# EAGLE design v2 (EAGLE 7.2.0)
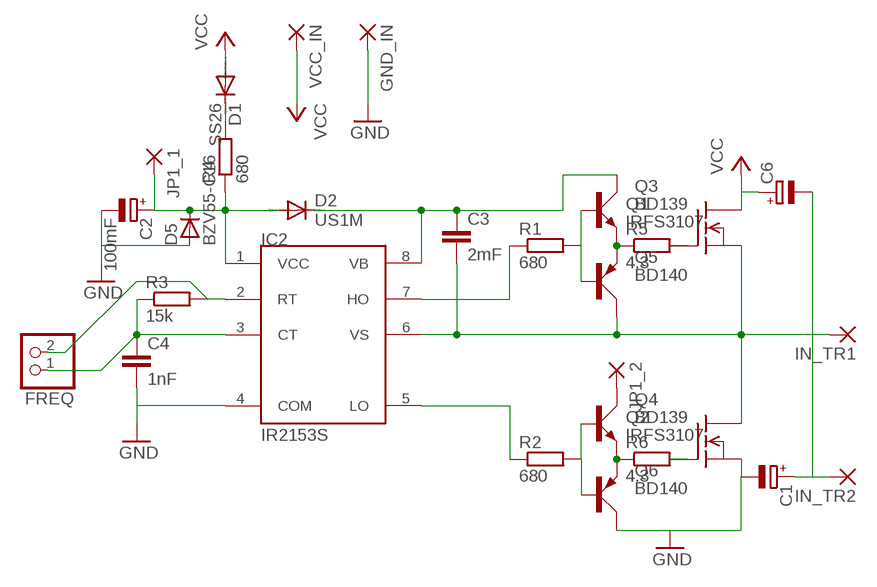
[diagram p0: schematic, sheet 1]

## Parts
C1  CPOL-EUE10-22.5  [EB22,5D]
C2  100mF  CPOL-EUE5-10.5  [E5-10,5]
C3  2mF  C-EUC0805  [C0805]
C4  1nF  C-EUC0805  [C0805]
C6  CPOL-EUE10-22.5  [EB22,5D]
D1  SS26  DIODE-DO-214AC  [DO-214AC]
D2  US1M  DIODE-DO-214AC  [DO-214AC]
D5  BZV55-C16  D-SOD-80  [SOD80]
FREQ  PINHD-1X2/90  [1X02/90]
GND_IN  SMD5  [SMD2,54-5,08]
IC2  IR2153S  [SO08]
IN_TR1  SMD5  [SMD2,54-5,08]
IN_TR2  SMD5  [SMD2,54-5,08]
JP1_1  1,6/0,8  [1,6/0,8]
JP1_2  1,6/0,8  [1,6/0,8]
Q1  IRFS3107  IRF510D2PAK  [D2PAK]
Q2  IRFS3107  IRF510D2PAK  [D2PAK]
Q3  BD139  [TO126AV]
Q4  BD139  [TO126AV]
Q5  BD140  [TO126AV]
Q6  BD140  [TO126AV]
R1  680  R-EU_R0805  [R0805]
R2  680  R-EU_R0805  [R0805]
R3  15k  R-EU_R0805  [R0805]
R4  680  R-EU_R0805  [R0805]
R5  4.3  R-EU_R0805  [R0805]
R6  4.3  R-EU_R0805  [R0805]
VCC_IN  SMD5  [SMD2,54-5,08]

## Nets
GND: C1.- C2.- C4.2 D5.2(A) GND_IN.1(P) IC2.4(COM) Q2.3(S) Q6.C
IN_TR1: C3.2 IC2.6(VS) IN_TR1.1(P) Q1.3(S) Q2.2(D) Q5.C
IN_TR2: C1.+ C6.- IN_TR2.1(P)
N$1: Q3.B Q5.B R1.2
N$2: Q4.B Q6.B R2.2
N$4: Q3.E Q5.E R5.1
N$5: Q4.E Q6.E R6.1
N$6: Q1.1(G) R5.2
N$7: FREQ.2 IC2.2(RT) R3.2
N$8: C4.1 FREQ.1 IC2.3(CT) R3.1
N$9: Q2.1(G) R6.2
N$10: IC2.7(HO) R1.1
N$11: IC2.5(LO) R2.1
N$12: D1.C R4.2
N$13: JP1_2.1(P) Q4.C
VB: C3.1 D2.C IC2.8(VB) Q3.C
VCC: C6.+ D1.A Q1.2(D) VCC_IN.1(P)
VCC_IR: C2.+ D2.A D5.1(C) IC2.1(VCC) JP1_1.1(P) R4.1

## Library data of the parts
C1 C2 C6 = rcl:CPOL-EU: POLARIZED CAPACITOR, European symbol
C3 C4 = rcl:C-EU: CAPACITOR, European symbol
D1 D2 = diode:DIODE-: DIODE
D5 = semicon-smd-ipc:D-: DIODE unfilled
FREQ = pinhead:PINHD-1X2: PIN HEADER
GND_IN IN_TR1 IN_TR2 VCC_IN = wirepad:SMD5: SMD PAD
IC2 = irs:IR2153
JP1_1 JP1_2 = wirepad:1,6/0,8: THROUGH-HOLE PAD
Q1 Q2 = my_mixed:IRF510: N-Channel Enhancement MOSFET (HEXFET); 100V; 5,6A; 0,54Ohm
Q3 Q4 = transistor-power:BD139: NPN TRANSISTOR
Q5 Q6 = transistor-power:BD140: PNP TRANSISTOR
R1-R6 = rcl:R-EU_: RESISTOR, European symbol

## Board
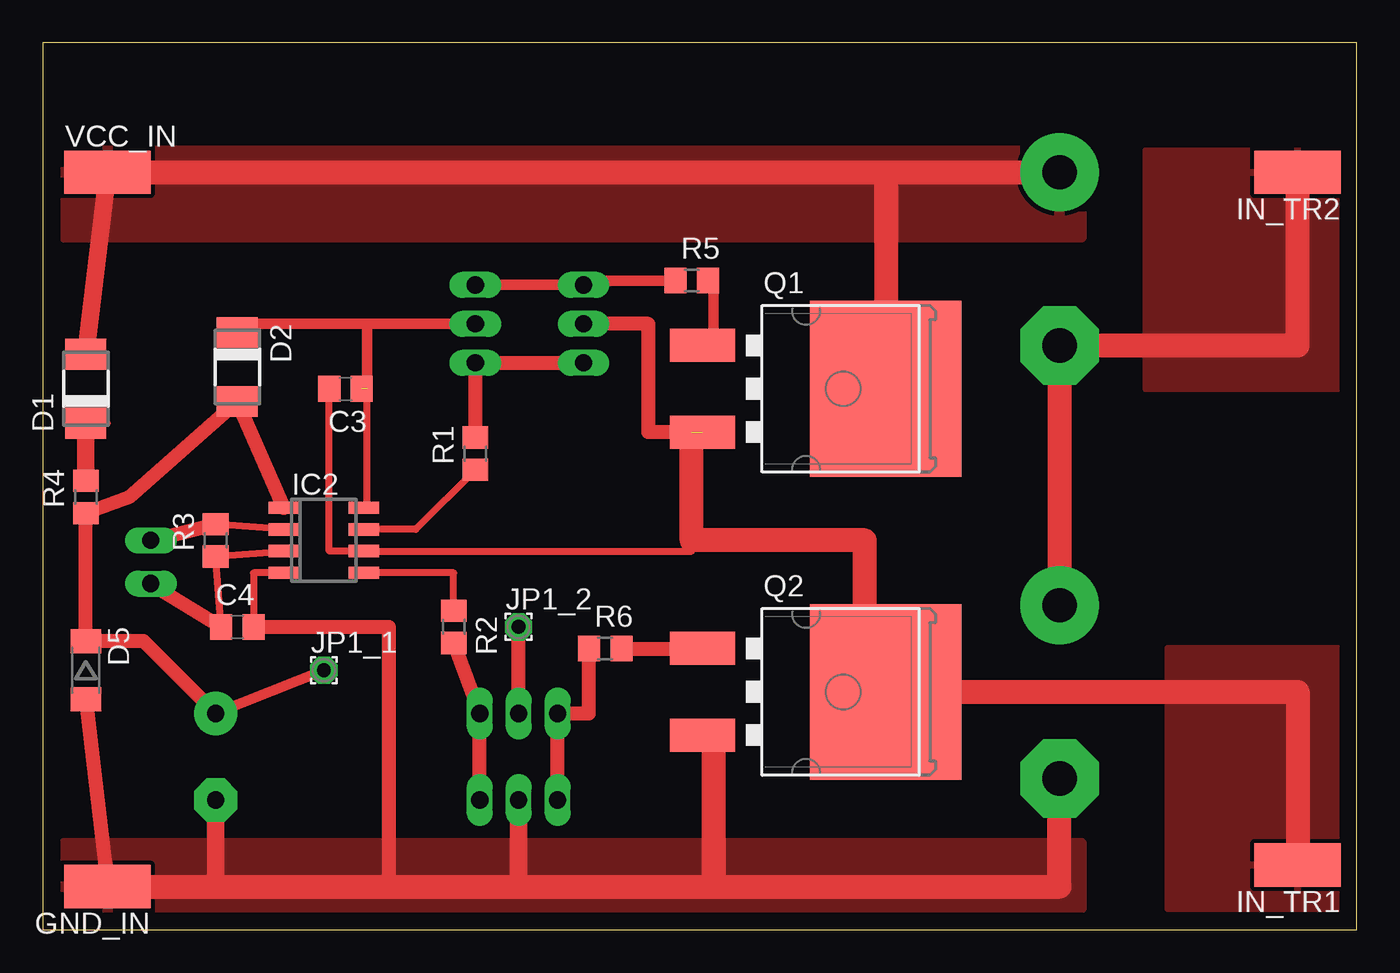
[diagram p1: board, top side]
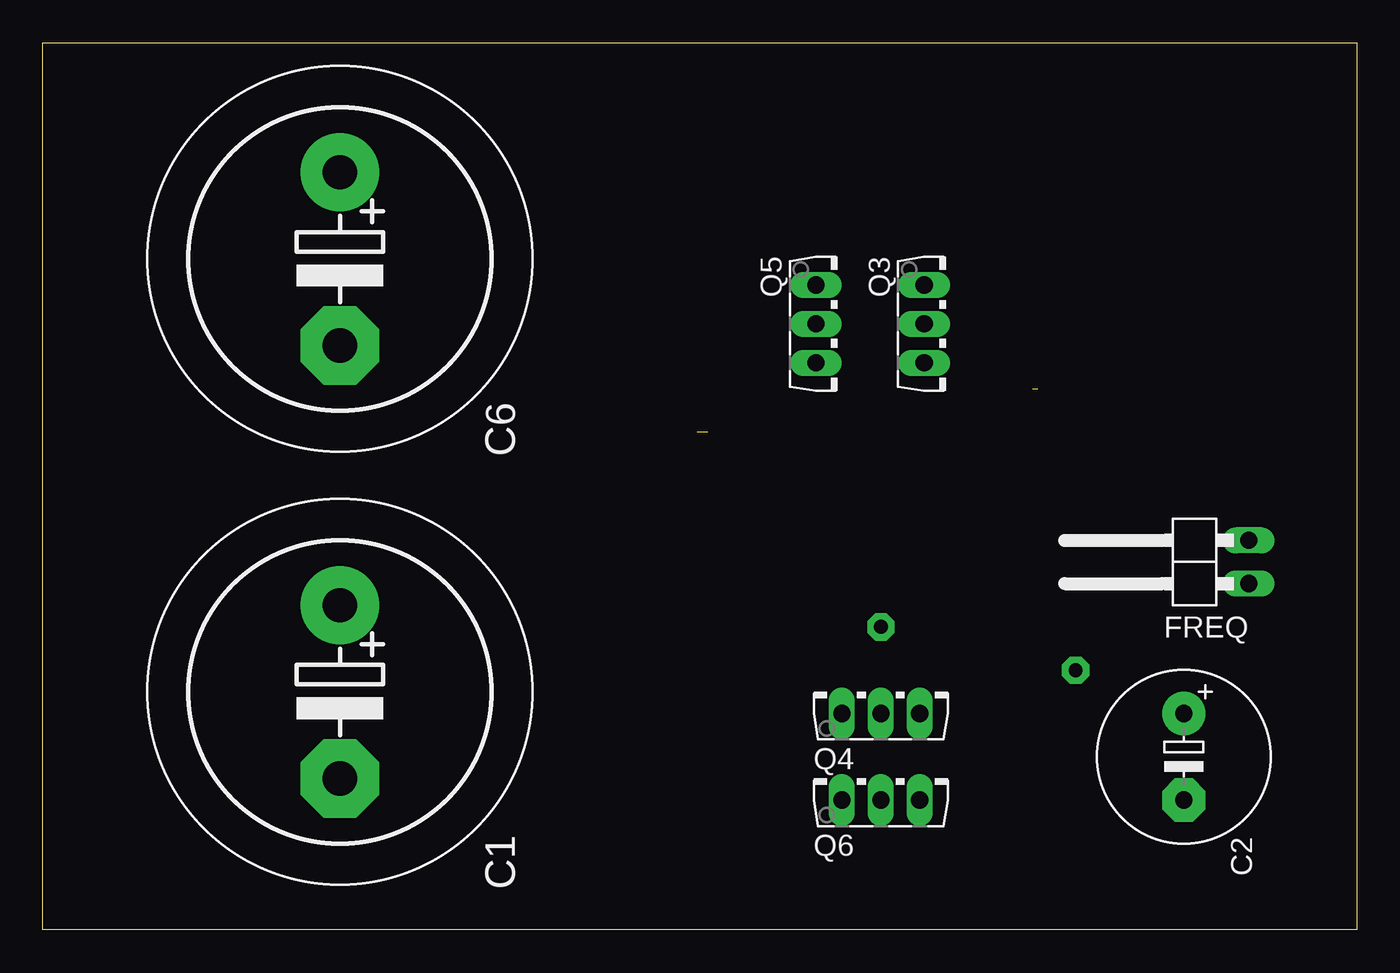
[diagram p2: board, bottom side, seen from below]

Size 77.14 x 52.06 mm. Coordinates in mm from the lower left corner, seen from the top.
Outline: 0,0 77.14,0 77.14,52.06 0,52.06 0,0
Copper layers (1*16): Top 0.035mm / dielectric 1.5mm / Bottom 0.035mm
Design rules "default": minimum track width 10mil, minimum drill 24mil, track to track 8mil, track to pad 8mil, pad to pad 8mil, via to via 8mil, smd to smd 8mil, copper to edge 40mil, drill to drill 8mil, minimum pad ring 10mil, minimum via ring 8mil, stop-mask expansion 4mil, vias tented up to drill 0mil, thermal gap 10mil

### Footprints (pad centres in the part's own frame; a part is rotated, then mirrored left to right if it is on the bottom)
EB22,5D = drill 2.007 pad 4.597: + -5.08,0 | drill 2.007 pad 4.597 octagon: - 5.08,0
E5-10,5 = drill 1.016 pad 2.54: + -2.54,0 | drill 1.016 pad 2.54 octagon: - 2.54,0
C0805 = smd 1.3 x 1.5: 1 -0.95,0; 2 0.95,0
DO-214AC = smd 1.8 x 2.4: A 2.025,0; C -2.025,0
SOD80 = smd 1.4 x 1.8: 1 -1.7,0; 2 1.7,0
1X02/90 = drill 1.016 long: 1 -1.27,-3.81; 2 1.27,-3.81
SMD2,54-5,08 = smd 2.54 x 5.08: 1 0,0
SO08 = smd 0.72 x 1.78: 1 -1.905,-2.35; 2 -0.635,-2.35; 3 0.635,-2.35; 4 1.905,-2.35; 5 1.905,2.35; 6 0.635,2.35; 7 -0.635,2.35; 8 -1.905,2.35
1,6/0,8 = drill 0.813 pad 1.6 octagon: 1 0,0
D2PAK = smd 1.93 x 3.81: 1 -2.55,-8.25; 3 2.55,-8.25 | smd 10.3 x 8.9: 2 0,2.5
TO126AV = drill 1.016 long: B 2.286,-1.27; C 0,-1.27; E -2.286,-1.27
R0805 = smd 1.3 x 1.5: 1 -0.95,0; 2 0.95,0

### Placement (x,y rotation side)
C1  59.69,13.97 270 bottom
C2  10.16,10.16 270 bottom
C3  17.78,31.75 180 top
C4  11.43,17.78 0 top
C6  59.69,39.37 270 bottom
D1  2.54,31.75 90 top
D2  11.43,33.02 270 top
D5  2.54,15.24 270 top
FREQ  10.16,21.59 90 bottom
GND_IN  3.81,2.54 90 top
IC2  16.51,22.86 270 top
IN_TR1  73.66,3.81 90 top
IN_TR2  73.66,44.45 90 top
JP1_1  16.51,15.24 0 top
JP1_2  27.94,17.78 0 top
Q1  46.99,31.75 270 top
Q2  46.99,13.97 270 top
Q3  24.13,35.56 270 bottom
Q4  27.94,13.97 0 bottom
Q5  30.48,35.56 270 bottom
Q6  27.94,8.89 0 bottom
R1  25.4,27.94 90 top
R2  24.13,17.78 270 top
R3  10.16,22.86 90 top
R4  2.54,25.4 90 top
R5  38.1,38.1 0 top
R6  33.02,16.51 0 top
VCC_IN  3.81,44.45 270 top

### Tracks (layer width: path | path; a pad name or v marks a point on that pad's centre or on a via)
GND
  Top 0.406: IC2.4 12.38,20.95 C4.2
  Top 0.813: D5.2 GND_IN.1 | C4.2 20.32,17.78 20.32,2.54
  Top 1.016: Q6.C 27.94,2.54 | C2.- 10.16,2.54
  Top 1.422: GND_IN.1 10.16,2.54 20.32,2.54 27.94,2.54 39.37,2.54 | 39.37,2.54 59.69,2.54 C1.- | Q2.3 39.37,11.42 39.37,2.54
  pour Top: 1.27,5.08 60.96,5.08 60.96,1.27 1.27,1.27
IN_TR1  (1 unrouted)
  Top 0.406: 38.1,22.86 38.1,22.23 IC2.6 16.83,22.23 C3.2
  Top 0.813: 38.1,29.21 35.56,29.21 35.56,35.56 Q5.C
  Top 1.422: IN_TR1.1 73.66,13.97 Q2.2 48.26,13.97 48.26,22.86 38.1,22.86 38.1,29.21
  pour Top: 76.2,1.27 76.2,16.51 66.04,16.51 66.04,1.27
IN_TR2
  Top 1.422: C1.+ C6.- 73.66,34.29 IN_TR2.1
  pour Top: 64.77,45.72 76.2,45.72 76.2,31.75 64.77,31.75
N$1
  Top 0.813: R1.2 Q3.B Q5.B
N$2
  Top 0.813: R2.2 Q4.B Q6.B
N$4
  Top 0.61: Q3.E Q5.E 32,38.1 R5.1
N$5
  Top 0.813: Q6.E Q4.E 32.07,12.7 R6.1
N$6
  Top 0.61: R5.2 39.37,38.1 39.37,34.29 Q1.1
N$7
  Top 0.406: IC2.2 R3.2
  Top 0.813: FREQ.2 R3.2
N$8
  Top 0.406: C4.1 R3.1 IC2.3
  Top 0.813: FREQ.1 C4.1
N$9
  Top 0.813: R6.2 Q2.1
N$10
  Top 0.406: R1.1 21.91,23.5 IC2.7
N$11
  Top 0.406: R2.1 24.13,20.95 IC2.5
N$12
  Top 0.254: 3.89,29.72 D1.C
  Top 1.016: D1.C R4.2
N$13
  Top 0.813: Q4.C JP1_2.1
VB  (1 unrouted)
  Top 0.406: IC2.8 19.05,24.95 19.05,31.75
  Top 0.61: D2.C 11.95,35.56 19.05,35.56 | 19.05,35.56 Q3.C | 19.05,31.75 19.05,35.56
VCC
  Top 1.016: VCC_IN.1 D1.A
  Top 1.422: VCC_IN.1 49.53,44.45 | 49.53,44.45 C6.+ | Q1.2 49.53,31.75 49.53,44.45
  pour Top: 1.27,45.72 60.96,45.72 60.96,40.64 1.27,40.64
VCC_IR
  Top 0.61: C2.+ JP1_1.1
  Top 0.813: C2.+ 5.92,16.94 D5.1 R4.1 5.08,25.4 D2.A IC2.1